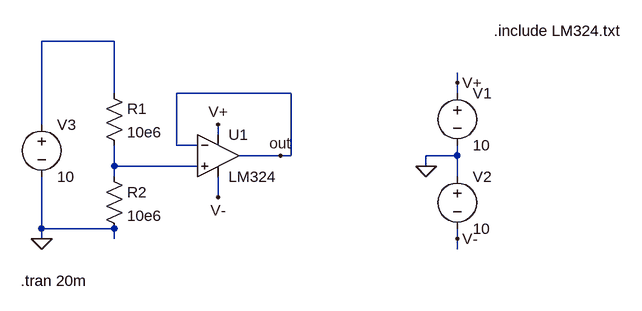
[diagram p0: schematic Aufgabe_2.2.asc]
Aufgabe_2.2.asc, the LTspice schematic file:
Version 4
SHEET 1 880 680
WIRE 32 -32 -80 -32
WIRE 560 32 560 16
WIRE 32 48 32 -32
WIRE 304 48 128 48
WIRE 560 48 560 32
WIRE -80 96 -80 -32
WIRE 192 112 192 96
WIRE 128 128 128 48
WIRE 160 128 128 128
WIRE 288 144 224 144
WIRE 304 144 304 48
WIRE 304 144 288 144
WIRE 560 144 560 128
WIRE 560 144 512 144
WIRE 32 160 32 128
WIRE 160 160 32 160
WIRE 512 160 512 144
WIRE 32 176 32 160
WIRE 560 176 560 144
WIRE 192 208 192 176
WIRE -80 256 -80 176
WIRE 32 256 -80 256
WIRE -80 272 -80 256
WIRE 32 272 32 256
WIRE 560 272 560 256
WIRE 560 288 560 272
FLAG 512 160 0
FLAG 560 32 V+
FLAG 560 272 V-
FLAG 192 96 V+
FLAG 192 208 V-
FLAG 288 144 out
FLAG -80 272 0
SYMBOL Opamps\\opamp2 192 80 R0
SYMATTR InstName U1
SYMATTR Value LM324
SYMBOL voltage 560 32 R0
WINDOW 123 0 0 Left 2
WINDOW 39 0 0 Left 2
SYMATTR InstName V1
SYMATTR Value 10
SYMBOL voltage 560 160 R0
WINDOW 123 0 0 Left 2
WINDOW 39 0 0 Left 2
SYMATTR InstName V2
SYMATTR Value 10
SYMBOL res 16 32 R0
SYMATTR InstName R1
SYMATTR Value 10e6
SYMBOL res 16 160 R0
SYMATTR InstName R2
SYMATTR Value 10e6
SYMBOL voltage -80 80 R0
WINDOW 123 0 0 Left 0
WINDOW 39 0 0 Left 0
SYMATTR InstName V3
SYMATTR Value 10
TEXT 616 -48 Left 2 !.include LM324.txt
TEXT -112 336 Left 2 !.tran 20m

The netlist it stands for:
* Aufgabe_2.2.asc
XU1 N002 out V+ V- out LM324  ; pins In+ In- V+ V- OUT
V1 V+ 0 10
V2 0 V- 10
R1 N001 N002 10e6
R2 N002 0 10e6
V3 N001 0 10
.include LM324.txt
.tran 20m
.backanno
.end